# Altium schematic sheet Sheet1.SchDoc
size A3; SheetNumber: 1; SheetTotal: 5
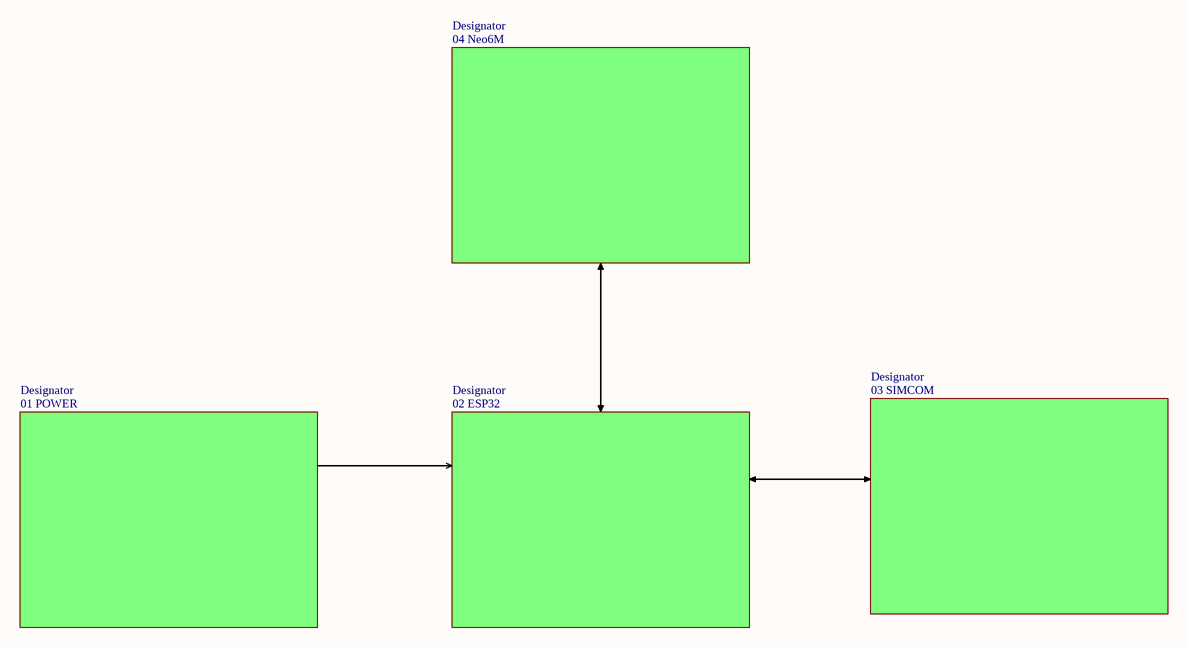
[diagram p0: Sheet1.SchDoc]

## Sub-sheets
Designator = 01 POWER: no entries
Designator = 02 ESP32: no entries
Designator = 03 SIMCOM: no entries
Designator = 04 Neo6M: no entries